# Altium schematic sheet 18_VGA.SchDoc: Apalis Evaluation Board 1.1
size A3; Organization: Toradex AG; Address1: Altsagenstrasse 5; Address2: Horw; Address3: 6048; Address4: Switzerland; DocumentNumber: 20; Revision: V1.1; SheetNumber: 20; SheetTotal: 32; PageSetup: Record=PageOptions|CenterHorizontal=True|CenterVertical=True|PrintScale=0.73|XCorrection=1.00|YCorrection=1.00|PrintKind=0|BorderSize=5000000|LeftOffset=0|BottomOffset=0|Orientation=2|PaperLength=1000|PaperWidth=1000|Scale=100|PaperSource=7|PrintQuality=-4|MediaType=1|DitherType=10|PaperKind=A4|PrintScaleMode=1
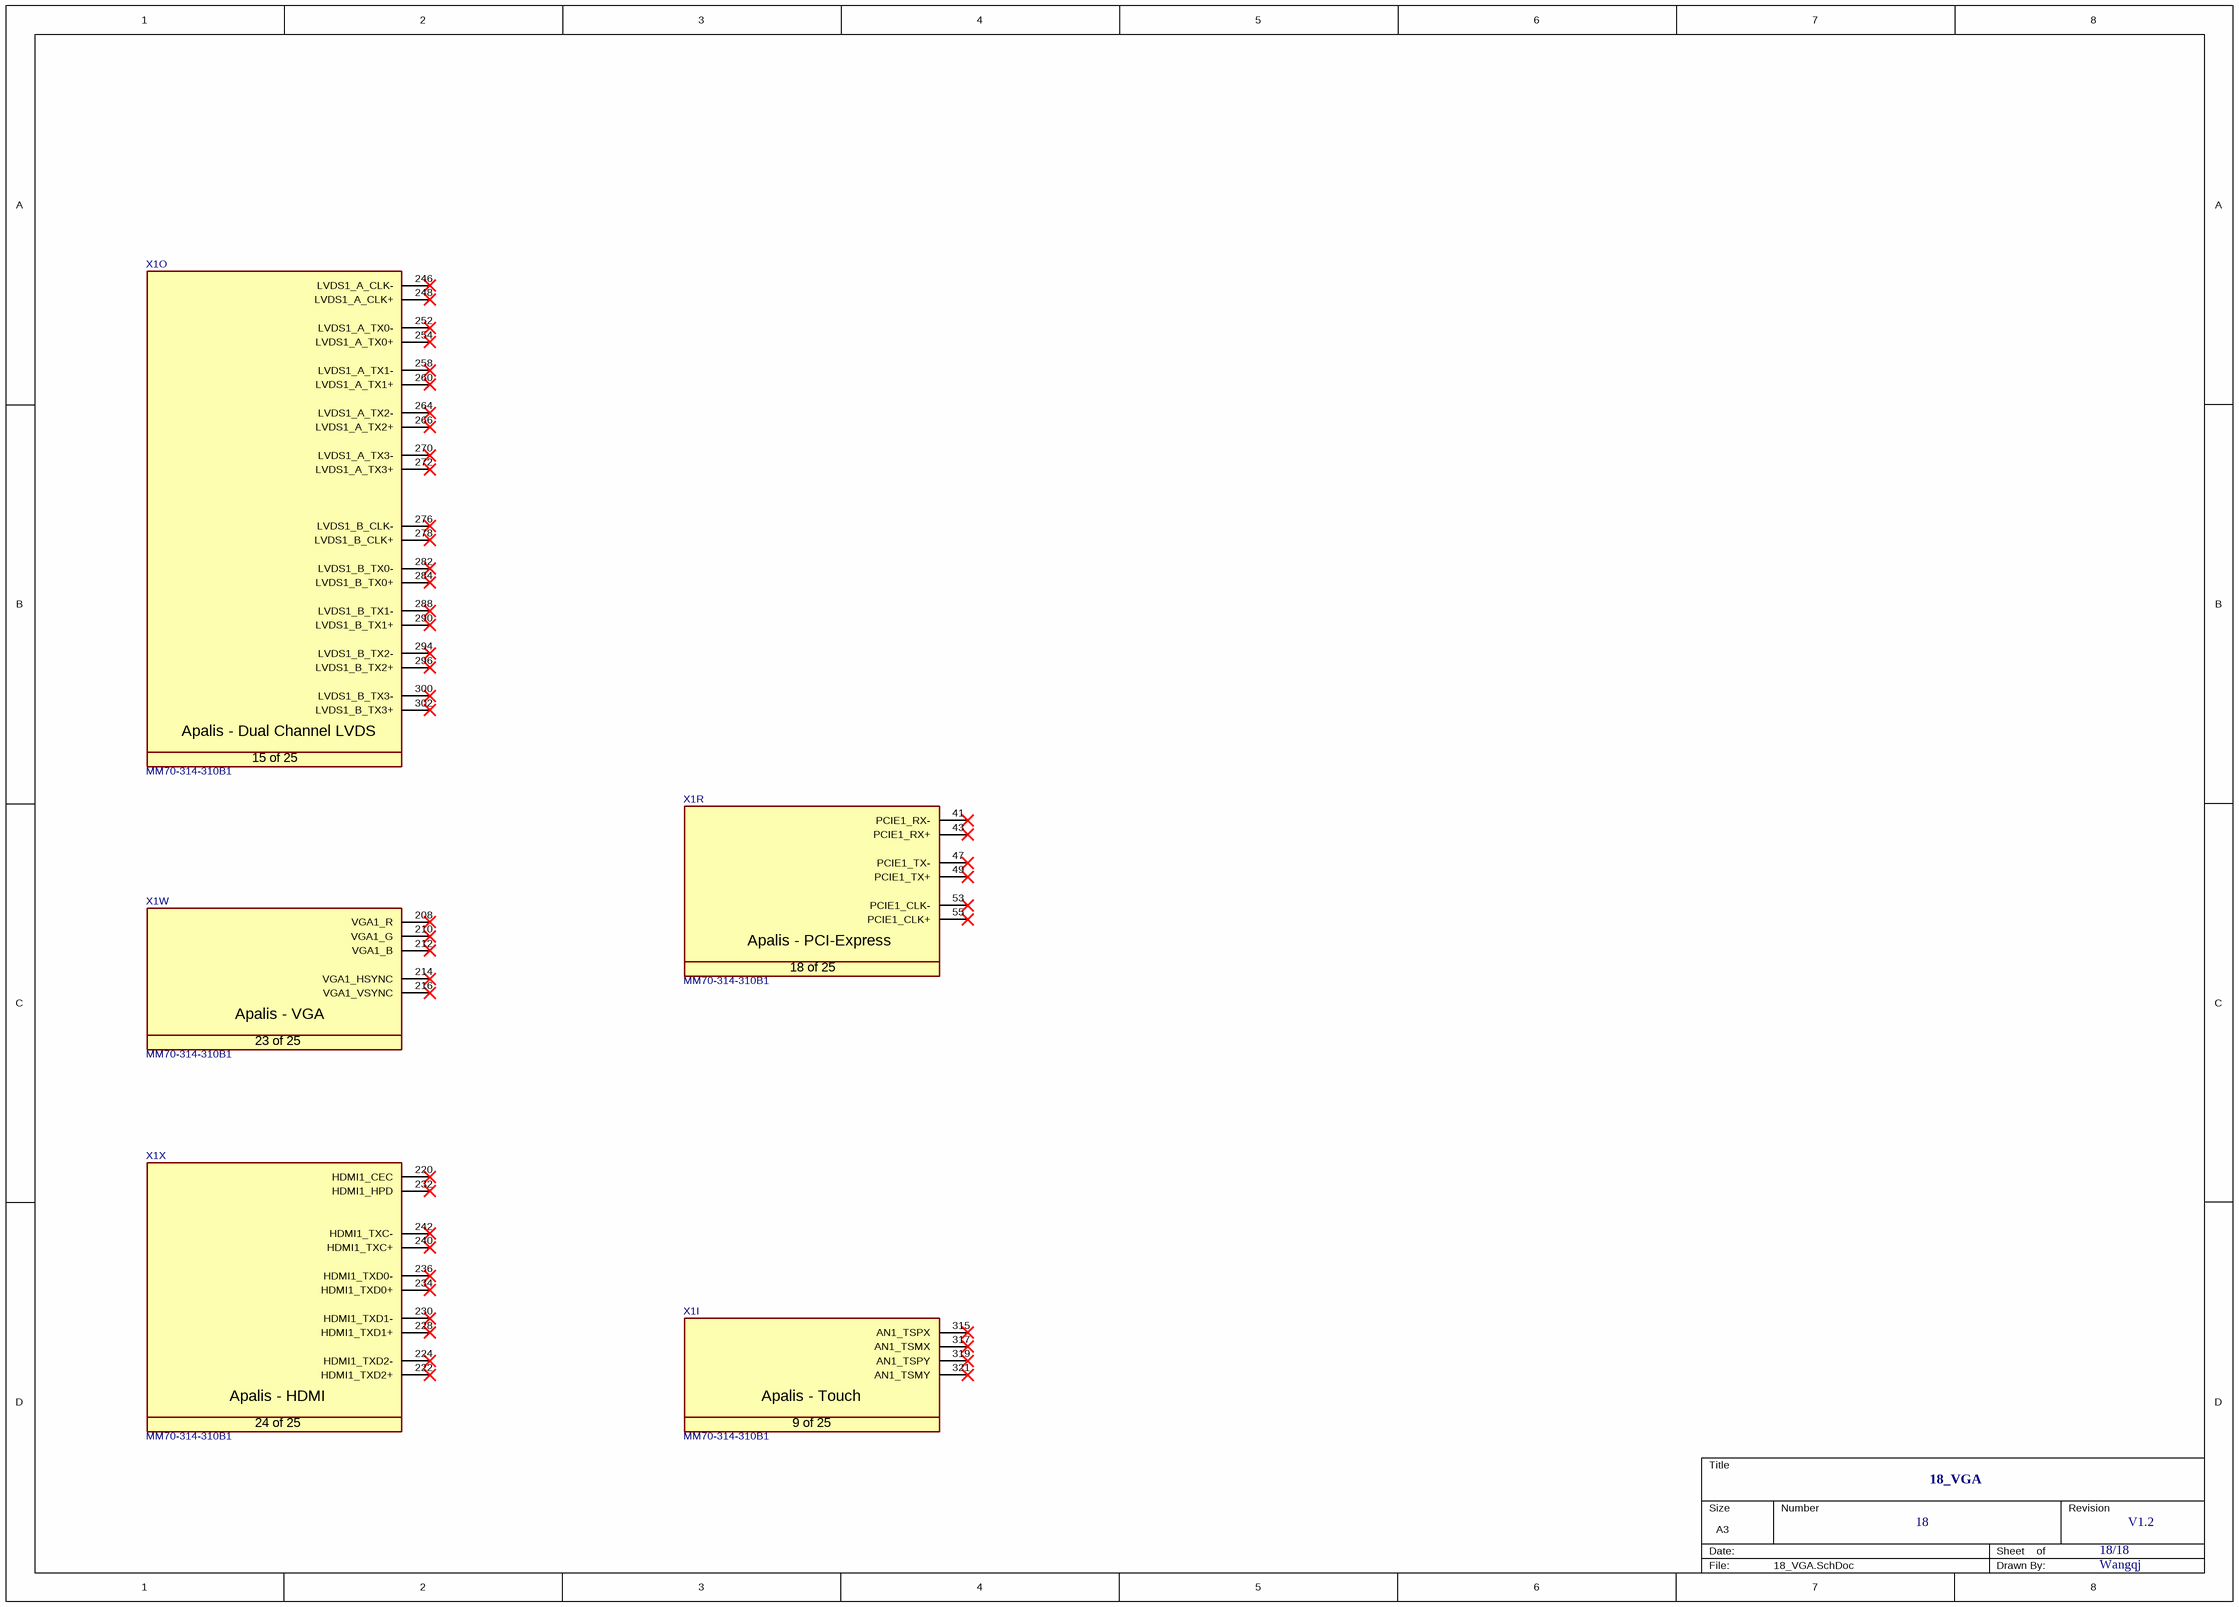
[diagram p0: 18_VGA.SchDoc]

## Parts
X1  Manufacturer Part No.: MM70-314-310B1  [T_JAE_MM70-314-310B1]  (hidden comment: CON-JAE-MM70-314-310B1-314-0.5mm)  (parts I,O,R,W,X of 25)

## Nets

Not connected (* = marked no-connect by the designer): X1 41(PCIE1_RX-)* 43(PCIE1_RX+)* 47(PCIE1_TX-)* 49(PCIE1_TX+)* 53(PCIE1_CLK-)* 55(PCIE1_CLK+)* 208(VGA1_R)* 210(VGA1_G)* 212(VGA1_B)* 214(VGA1_HSYNC)* 216(VGA1_VSYNC)* 220(HDMI1_CEC)* 222(HDMI1_TXD2+)* 224(HDMI1_TXD2-)* 228(HDMI1_TXD1+)* 230(HDMI1_TXD1-)* 232(HDMI1_HPD)* 234(HDMI1_TXD0+)* 236(HDMI1_TXD0-)* 240(HDMI1_TXC+)* 242(HDMI1_TXC-)* 246(LVDS1_A_CLK-)* 248(LVDS1_A_CLK+)* 252(LVDS1_A_TX0-)* 254(LVDS1_A_TX0+)* 258(LVDS1_A_TX1-)* 260(LVDS1_A_TX1+)* 264(LVDS1_A_TX2-)* 266(LVDS1_A_TX2+)* 270(LVDS1_A_TX3-)* 272(LVDS1_A_TX3+)* 276(LVDS1_B_CLK-)* 278(LVDS1_B_CLK+)* 282(LVDS1_B_TX0-)* 284(LVDS1_B_TX0+)* 288(LVDS1_B_TX1-)* 290(LVDS1_B_TX1+)* 294(LVDS1_B_TX2-)* 296(LVDS1_B_TX2+)* 300(LVDS1_B_TX3-)* 302(LVDS1_B_TX3+)* 315(AN1_TSPX)* 317(AN1_TSMX)* 319(AN1_TSPY)* 321(AN1_TSMY)*

## Notes on the sheet
- 18_VGA
- 18
- 18/18
- V1.2
- Wangqj
- Title
- Size:
- Date:
- A3
- Number:
- Time:
- Revision:
- Sheet
- of
- File:
- (in symbol CON-JAE-MM70-314-310B1-314-0.5mm, part I) Apalis - Touch; 9 of 25
- (in symbol CON-JAE-MM70-314-310B1-314-0.5mm, part O) Apalis - Dual Channel LVDS; 15 of 25
- (in symbol CON-JAE-MM70-314-310B1-314-0.5mm, part R) Apalis - PCI-Express; 18 of 25
- (in symbol CON-JAE-MM70-314-310B1-314-0.5mm, part W) Apalis - VGA; 23 of 25
- (in symbol CON-JAE-MM70-314-310B1-314-0.5mm, part X) Apalis - HDMI; 24 of 25

## Library data of the parts
X1 = CON-JAE-MM70-314-310B1-314-0.5mm: MXM3 Connector; Manufacturer Name: JAE; No. of ways: 314